# Altium schematic sheet Schematic.SchDoc
size A4; SheetNumber: 1; SheetTotal: 1
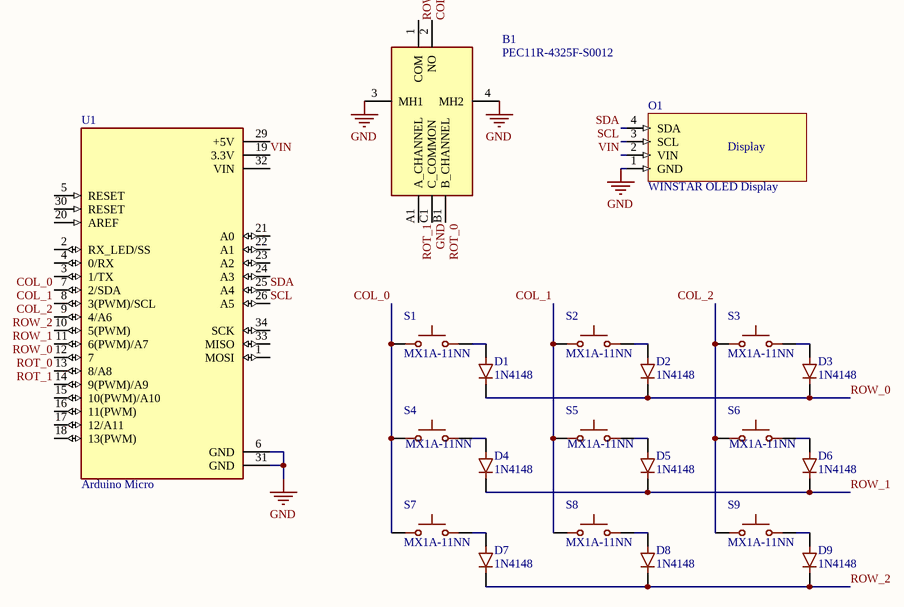
[diagram p0: Schematic.SchDoc]

## Parts
B1  PEC11R-4325F-S0012  [PEC11R-4315F-S0012]
D1  1N4148  [1N4148 Diode]
D2  1N4148  [1N4148 Diode]
D3  1N4148  [1N4148 Diode]
D4  1N4148  [1N4148 Diode]
D5  1N4148  [1N4148 Diode]
D6  1N4148  [1N4148 Diode]
D7  1N4148  [1N4148 Diode]
D8  1N4148  [1N4148 Diode]
D9  1N4148  [1N4148 Diode]
O1  WINSTAR OLED Display  [WINSTAR OLED Display]
S1  MX1A-11NN  [SW_MX1A-11NN]
S2  MX1A-11NN  [SW_MX1A-11NN]
S3  MX1A-11NN  [SW_MX1A-11NN]
S4  MX1A-11NN  [SW_MX1A-11NN]
S5  MX1A-11NN  [SW_MX1A-11NN]
S6  MX1A-11NN  [SW_MX1A-11NN]
S7  MX1A-11NN  [SW_MX1A-11NN]
S8  MX1A-11NN  [SW_MX1A-11NN]
S9  MX1A-11NN  [SW_MX1A-11NN]
U1  Arduino Micro  [Arduino Micro]

## Nets
GND: B1.3(MH1) B1.4(MH2) B1.C1(C_COMMON) O1.1(GND) U1.6(GND) U1.31(GND)
COL_0: B1.2(NO) S1.1 S4.1 S7.1 U1.7(2/SDA)
COL_1: S2.1 S5.1 S8.1 U1.8(3(PWM)/SCL)
COL_2: S3.1 S6.1 S9.1 U1.9(4/A6)
ROT_0: B1.B1(B_CHANNEL) U1.13(8/A8)
ROT_1: B1.A1(A_CHANNEL) U1.14(9(PWM)/A9)
ROW_0: B1.1(COM) D1.K D2.K D3.K U1.12(7)
ROW_1: D4.K D5.K D6.K U1.11(6(PWM)/A7)
ROW_2: D7.K D8.K D9.K U1.10(5(PWM))
SCL: O1.3(SCL) U1.26(A5)
SDA: O1.4(SDA) U1.25(A4)
VIN: O1.2(VIN) U1.19(3.3V)
NetD1_A: D1.A S1.2
NetD2_A: D2.A S2.2
NetD3_A: D3.A S3.2
NetD4_A: D4.A S4.2
NetD5_A: D5.A S5.2
NetD6_A: D6.A S6.2
NetD7_A: D7.A S7.2
NetD8_A: D8.A S8.2
NetD9_A: D9.A S9.2

Not connected (* = marked no-connect by the designer): U1 1(MOSI) 2(RX_LED/SS) 3(1/TX) 4(0/RX) 5(RESET) 15(10(PWM)/A10) 16(11(PWM)) 17(12/A11) 18(13(PWM)) 20(AREF) 21(A0) 22(A1) 23(A2) 24(A3) 29(+5V) 30(RESET) 32(VIN) 33(MISO) 34(SCK)

## Notes on the sheet
- (in symbol WINSTAR OLED Display) Display

## Library data of the parts
B1 = PEC11R-4315F-S0012: Rotary Encoder Mechanical 12 Quadrature (Incremental) Vertical; Manufacturer_Name: Bourns; Geometry.Height: 31.5mm; Manufacturer_Part_Number: PEC11R-4325F-S0012; Mouser Part Number: 652-PEC11R4325FS0012; Mouser Price/Stock: https://www.mouser.co.uk/ProductDetail/Bourns/PEC11R-4325F-S0012?qs=Zq5ylnUbLm4xKJFZnkQTMQ%3D%3D; Arrow Part Number: *; Arrow Price/Stock: *; Datasheet Link: https://www.bourns.com/docs/product-datasheets/pec11r.pdf
D1-D9 = 1N4148: Diode Standard 75V 200mA Surface Mount SOD-523F; MF: ON Semiconductor; SnapEDA_Link: https://www.snapeda.com/parts/1N4148/Onsemi/view-part/?ref=snap; Package: AXIAL LEAD-2 ON Semiconductor; Value: *; MP: 1N4148; Check_prices: https://www.snapeda.com/parts/1N4148/Onsemi/view-part/?ref=eda
O1 = WINSTAR OLED Display: WEA012832FWPP3N00000; ComponentLink1Description: New link; ComponentLink1URL: https://www.soselectronic.com/pl-pl/products/winstar/wea012832fwpp3n00000-401631
S1-S9 = MX1A-11NN: Switch,Key,SPST-NO,Keyboard,Low Profile,10mA,12VDC,Face Place Mount,Std Force | Cherry Americas MX1A-11NN; SnapEDA_Link: https://www.snapeda.com/parts/MX1A-11NN/Cherry/view-part/?ref=snap; Package: None; Value: *; MF: Cherry; MP: MX1A-11NN; Check_prices: https://www.snapeda.com/parts/MX1A-11NN/Cherry/view-part/?ref=eda
U1 = Arduino Micro: Microcontroller board based on the ATmega32u4; SnapEDA_Link: https://www.snapeda.com/parts/Arduino%20Micro/Arduino/view-part/?ref=snap; Package: Non-Standard Arduino; Value: *; MF: Arduino; MP: Arduino Micro; Check_prices: https://www.snapeda.com/parts/Arduino%20Micro/Arduino/view-part/?ref=eda